# Altium schematic sheet [07]RFID_LCD.SchDoc
size A4
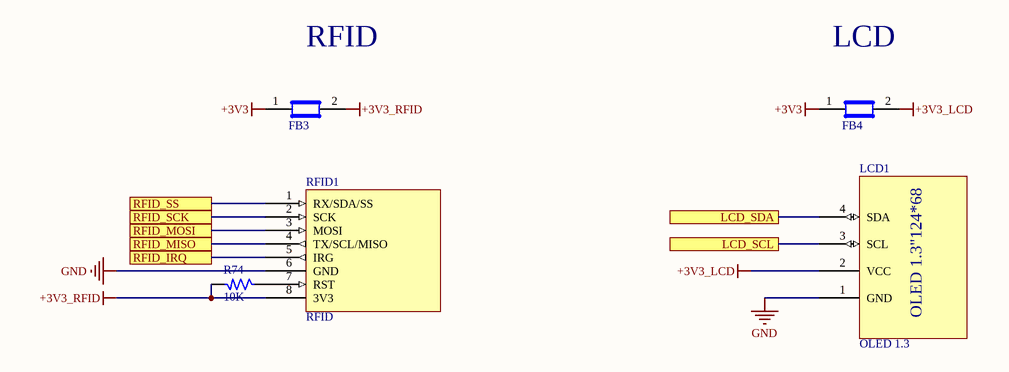
[diagram p0: [07]RFID_LCD.SchDoc]

## Parts
FB3  BLM21PG600SN1D  [R0805]  (value not drawn)
FB4  BLM21PG600SN1D  [R0805]  (value not drawn)
LCD1  OLED 1.3  [CON_4P]
R74  10K  [RES-SMD-0805]
RFID1  RFID  [RFID RC522]

## Ports
LCD_SCL, LCD_SDA, RFID_IRQ, RFID_MISO, RFID_MOSI, RFID_SCK, RFID_SS

## Nets
+3V3: FB3.1 FB4.1
+3V3_LCD: FB4.2 LCD1.2(VCC)
+3V3_RFID: FB3.2 R74.2 RFID1.8(3V3)
GND: LCD1.1(GND) RFID1.6(GND)
LCD_SCL: LCD1.3(SCL) ; port LCD_SCL
LCD_SDA: LCD1.4(SDA) ; port LCD_SDA
RFID_IRQ: RFID1.5(IRG) ; port RFID_IRQ
RFID_MISO: RFID1.4(TX/SCL/MISO) ; port RFID_MISO
RFID_MOSI: RFID1.3(MOSI) ; port RFID_MOSI
RFID_SCK: RFID1.2(SCK) ; port RFID_SCK
RFID_SS: RFID1.1(RX/SDA/SS) ; port RFID_SS
NetR74_1: R74.1 RFID1.7(RST)

## Notes on the sheet
- RFID
- LCD
- (in symbol OLED 1.3) OLED 1.3"124*68

## Library data of the parts
FB3 FB4 = Ferrite Bead
LCD1 = OLED 1.3: pin to pad: 1>4 2>3 3>2 4>1
R74 = RM: Resistor SMD; Value: 1K
RFID1 = RFID RC522